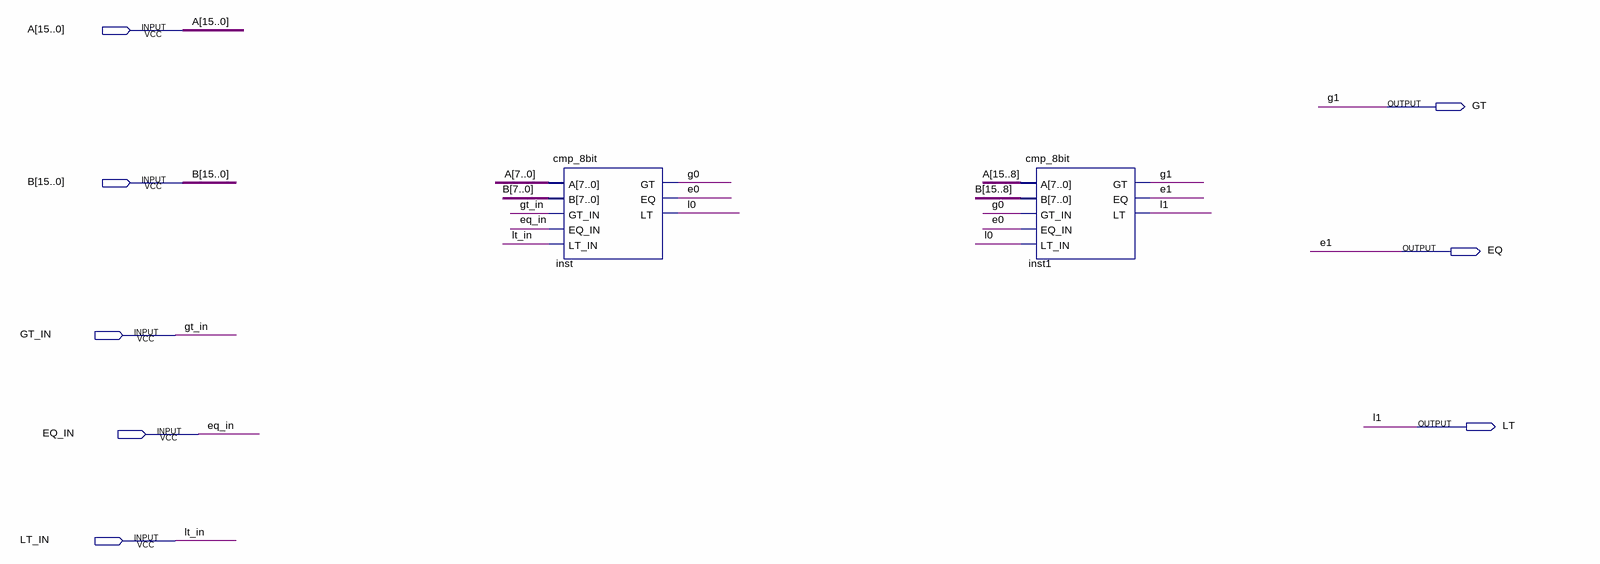
[diagram p0: schematic sheet]
// Quartus schematic cmp_16bit.bdf as structural Verilog: 2 symbols, 8 pins
module cmp_16bit (
  input  [15:0] A,
  input  [15:0] B,
  input  GT_IN,
  input  EQ_IN,
  input  LT_IN,
  output GT,
  output EQ,
  output LT
);

  wire e0, g0, l0;

  cmp_8bit inst (.A(A[7:0]), .B(B[7:0]), .GT_IN(GT_IN), .EQ_IN(EQ_IN), .LT_IN(LT_IN), .GT(g0), .EQ(e0), .LT(l0));
  cmp_8bit inst1 (.A(A[15:8]), .B(B[15:8]), .GT_IN(g0), .EQ_IN(e0), .LT_IN(l0), .GT(GT), .EQ(EQ), .LT(LT));

  // Other names for the same wires on the sheet: e1 = EQ; g1 = GT; l1 = LT
endmodule
